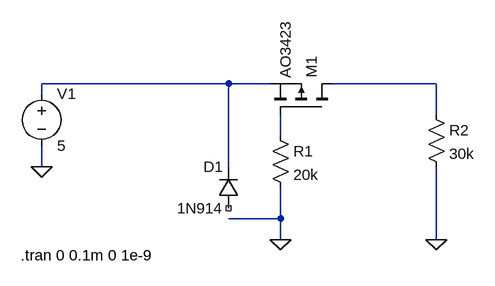
[diagram p0: schematic NFET_ENABLE.asc]
NFET_ENABLE.asc, the LTspice schematic file:
Version 4
SHEET 1 880 680
WIRE -32 64 -320 64
WIRE 32 64 -32 64
WIRE 288 64 128 64
WIRE -320 80 -320 64
WIRE 288 112 288 64
WIRE 48 144 48 112
WIRE -320 192 -320 160
WIRE -32 192 -32 64
WIRE 48 272 48 224
WIRE 48 272 -32 272
WIRE 48 304 48 272
WIRE 288 304 288 192
FLAG -320 192 0
FLAG 48 304 0
FLAG 288 304 0
SYMBOL pmos 128 112 M270
SYMATTR InstName M1
SYMATTR Value AO3423
SYMBOL diode -16 256 R180
WINDOW 0 24 64 Left 2
WINDOW 3 24 0 Left 2
SYMATTR InstName D1
SYMATTR Value 1N914
SYMBOL voltage -320 64 R0
WINDOW 123 0 0 Left 0
WINDOW 39 0 0 Left 0
SYMATTR InstName V1
SYMATTR Value 5
SYMBOL res 32 128 R0
SYMATTR InstName R1
SYMATTR Value 20k
SYMBOL res 272 96 R0
SYMATTR InstName R2
SYMATTR Value 30k
TEXT -352 328 Left 2 !.tran 0 0.1m 0 1e-9

The netlist it stands for:
* NFET_ENABLE.asc
M1 N002 N003 N001 N001 AO3423
D1 NC_01 N001 1N914
V1 N001 0 5
R1 N003 0 20k
R2 N002 0 30k
.model D D
.lib standard.dio
.model NMOS NMOS
.model PMOS PMOS
.lib standard.mos
.tran 0 0.1m 0 1e-9
.backanno
.end